# Altium schematic sheet karmanDB_gps&gs.SchDoc
size A
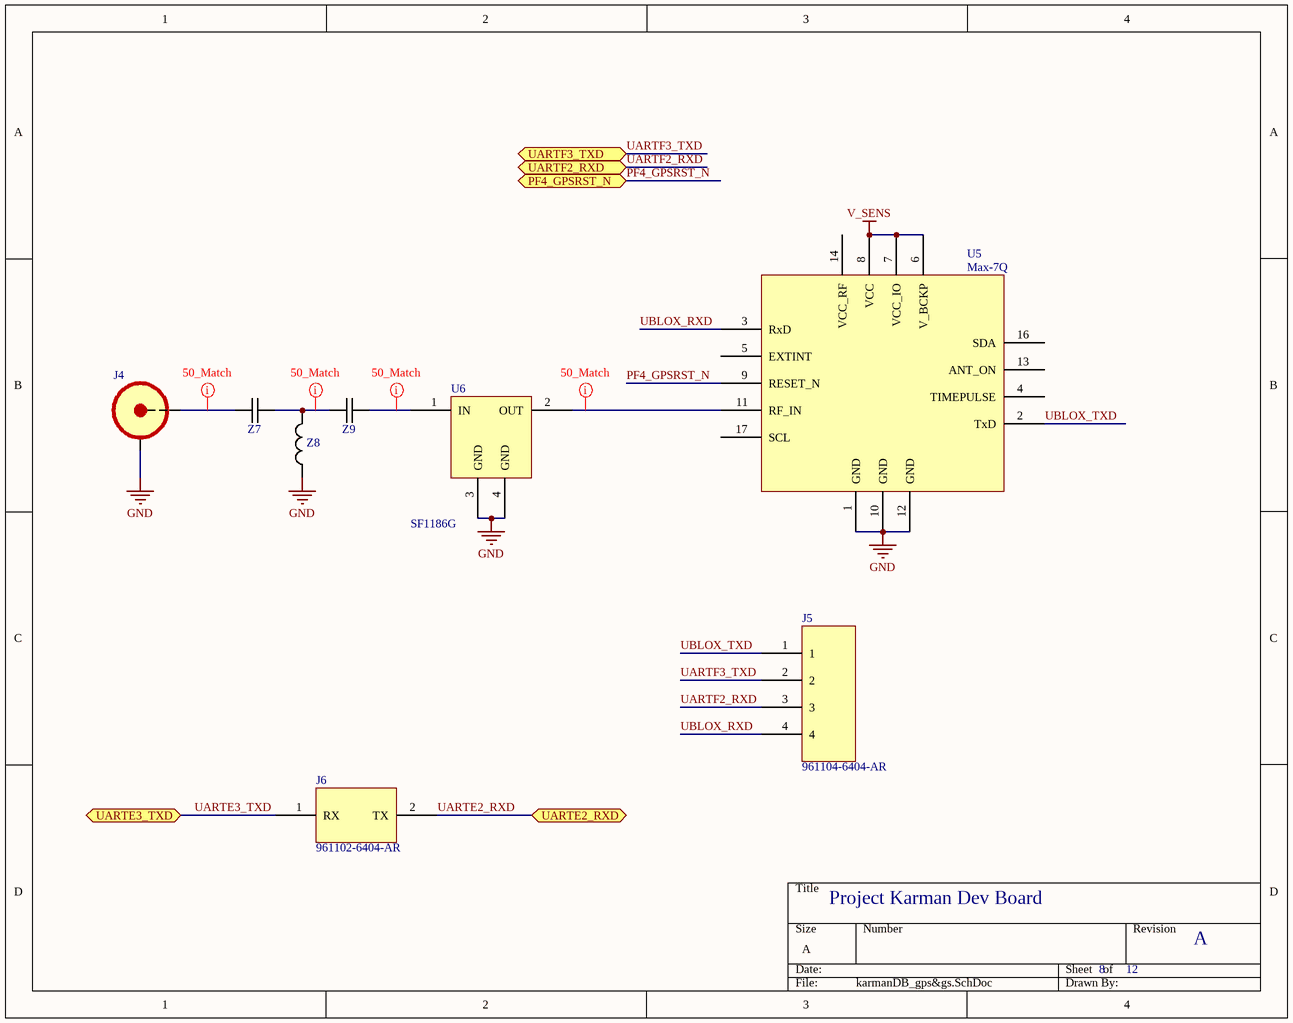
[diagram p0: karmanDB_gps&gs.SchDoc]

## Parts
J4  MOLEX_0733910060  [MOLEX_0733910060]  (value not drawn)
J5  961104-6404-AR  [961104-6404-AR]
J6  961102-6404-AR  [3M_961102-6X04]
U5  Max-7Q  [11 MAX-7Q]
U6  SF1186G  [sf1186g]
Z7  CAP_GENERIC_0402  [MURATA_GRM_0402]  (value not drawn)
Z8  IND_GENERIC_0402  [PANASONIC_ELJRF]  (value not drawn)
Z9  CAP_GENERIC_0402  [MURATA_GRM_0402]  (value not drawn)

## Ports
PF4_GPSRST_N (bidir), UARTE2_RXD (bidir), UARTE3_TXD (bidir), UARTF2_RXD (bidir), UARTF3_TXD (bidir)

## Nets
GND: J4.SHIELD U5.1(GND) U5.10(GND) U5.12(GND) U6.3(GND) U6.4(GND) Z8.1
V_SENS: U5.6(V_BCKP) U5.7(VCC_IO) U5.8(VCC)
PF4_GPSRST_N: U5.9(RESET_N) ; port PF4_GPSRST_N
UARTE2_RXD: J6.2(TX) ; port UARTE2_RXD
UARTE3_TXD: J6.1(RX) ; port UARTE3_TXD
UARTF2_RXD: J5.3 ; port UARTF2_RXD
UARTF3_TXD: J5.2 ; port UARTF3_TXD
UBLOX_RXD: J5.4 U5.3(RxD)
UBLOX_TXD: J5.1 U5.2(TxD)
NetJ4_PIN: J4.PIN Z7.1
NetU5_11: U5.11(RF_IN) U6.2(OUT)
NetU6_1: U6.1(IN) Z9.2
NetZ7_2: Z7.2 Z8.2 Z9.1

Not connected (* = marked no-connect by the designer): U5 4(TIMEPULSE) 5(EXTINT) 13(ANT_ON) 14(VCC_RF) 16(SDA) 17(SCL)

## Layout directives
net class 50_Match_Class: NetJ4_PIN, NetU5_11, NetU6_1, NetZ7_2

## Notes on the sheet
- Project Karman Dev Board
- 8
- 12
- A

## Library data of the parts
J4 = MOLEX_0733910060: CONN SMA JACK STR 50 OHM PCB; Manufacturer: Molex Inc; Connector Type: Jack, Female Socket; Contact Termination: Solder; Impedance: 50 Ohm; Frequency - Max: 18GHz; Body Material: Brass; Body Finish: Gold; Center Contact Material: Beryllium Copper; Dielectric Material: Polytetrafluoroethylene (PTFE); Voltage Rating: 500V; Supplier 1: Digi-Key; Manufacturer Part Number: 0733910060; RoHS: RoHS Compliant; Category: Connectors, Interconnects; Stock 1: 6663; Packaging: Bulk; Connector Style: SMA; Shield Termination: Solder; Mounting Type: Through Hole; Cable Group: -; Fastening Type: Threaded; Features: -; Housing Color: Gold; Ingress Protection: -; Center Contact Plating: Gold; Operating Temperature: -65°C ~ 165°C; ComponentLink1URL: http://www.molex.com/pdm_docs/sd/733910060_sd.pdf; ComponentLink1Description: http://www.molex.com/pdm_docs/sd/733910060_sd.pdf; Supplier Part Number 1: WM5543-ND; Pricing: 1=2.99, 10=2.87, 25=2.6308, 50=2.5114, 100=2.3918, 250=2.09284, 500=2.03304, 1000=1.73406, 2500=1.61446 (USD)
J5 = 961104-6404-AR: CONN HEADER VERT SGL 4POS GOLD; Manufacturer: 3M; Connector Type: Header, Unshrouded; Number of Positions: 4; Number of Positions Loaded: All; Pitch: 0.100" (2.54mm); Supplier 1: Digi-Key; Manufacturer Part Number: 961104-6404-AR; RoHS: RoHS Compliant; Category: Connectors, Interconnects; Stock 1: 17691; Pricing 1: 1=0.33, 10=0.315, 25=0.27, 50=0.2296, 100=0.2205, 250=0.198, 500=0.189, 1000=0.1575, 2500=0.144 (USD); Packaging: Bulk; Contact Type: Male Pin; Number of Rows: 1; Row Spacing: -; Contact Mating Length: 0.217" (5.50mm); Mounting Type: Through Hole; Termination: Solder; Fastening Type: -; Features: -; Contact Finish: Gold; Contact Finish Thickness: Flash; Color: Black; ComponentLink1URL: http://multimedia.3m.com/mws/mediawebserver?66666UuZjcFSLXTtNxTElX&VEVuQEcuZgVs6EVs6E666666--; ComponentLink1Description: http://multimedia.3m.com/mws/mediawebserver?66666UuZjcFSLXTtNxTElX&VEVuQEcuZgVs6EVs6E666666--; Supplier Part Number 1: 3M9449-ND
J6 = 961102-6404-AR: CONN HEADER VERT SGL 2POS GOLD; Manufacturer: 3M; Connector Type: Header, Unshrouded; Number of Positions: 2; Number of Positions Loaded: All; Pitch: 0.100" (2.54mm); Supplier 1: Digi-Key; Manufacturer Part Number: 961102-6404-AR; RoHS: RoHS Compliant; Category: Connectors, Interconnects; Stock 1: 60000; Pricing 1: 1=0.16, 10=0.15, 25=0.128, 50=0.112, 100=0.104, 250=0.092, 500=0.088, 1000=0.072, 2500=0.066 (USD); Packaging: Bulk; Contact Type: Male Pin; Number of Rows: 1; Row Spacing: -; Contact Mating Length: 0.217" (5.50mm); Mounting Type: Through Hole; Termination: Solder; Fastening Type: -; Features: -; Contact Finish: Gold; Contact Finish Thickness: Flash; Color: Black; ComponentLink1URL: http://multimedia.3m.com/mws/mediawebserver?66666UuZjcFSLXTtNxTElX&VEVuQEcuZgVs6EVs6E666666--; ComponentLink1Description: http://multimedia.3m.com/mws/mediawebserver?66666UuZjcFSLXTtNxTElX&VEVuQEcuZgVs6EVs6E666666--; Supplier Part Number 1: 3M9447-ND
U5 = Max-7Q: MAX-7Q ublox GPS chip
U6 = SF1186G: SAW Filter MuRata; Supplier 1: Digi-Key; Supplier Part Number 1: 583-1198-6-ND
Z7 Z9 = CAP_GENERIC_0402: Generic Capacitor 0402 Package; Capacitance: 1000pF; Category: Capacitors; Applications: General Purpose; Size / Dimension: 0.039" L x 0.020" W (1.00mm x 0.50mm); Package / Case: 0402 (1005 Metric); Mounting Type: Surface Mount, MLCC
Z8 = IND_GENERIC_0402: Generic Inductor 0402 Package; Mounting Type: Surface Mount; Package / Case: 0402 (1005 Metric)